# Altium schematic sheet 102709.SchDoc: EAX-500 Test Head Board
size A4; CompanyName: Detex Corp; DrawnBy: DMH; Engineer: DMH; Address2: Detex Corp; Address3: 302 Detex Dr; Address4: New Braunfels, TX 78130; DocumentNumber: 102709; Revision: A0; SheetNumber: 1; SheetTotal: 1; ProjectName: EAX-500 Test Head Board
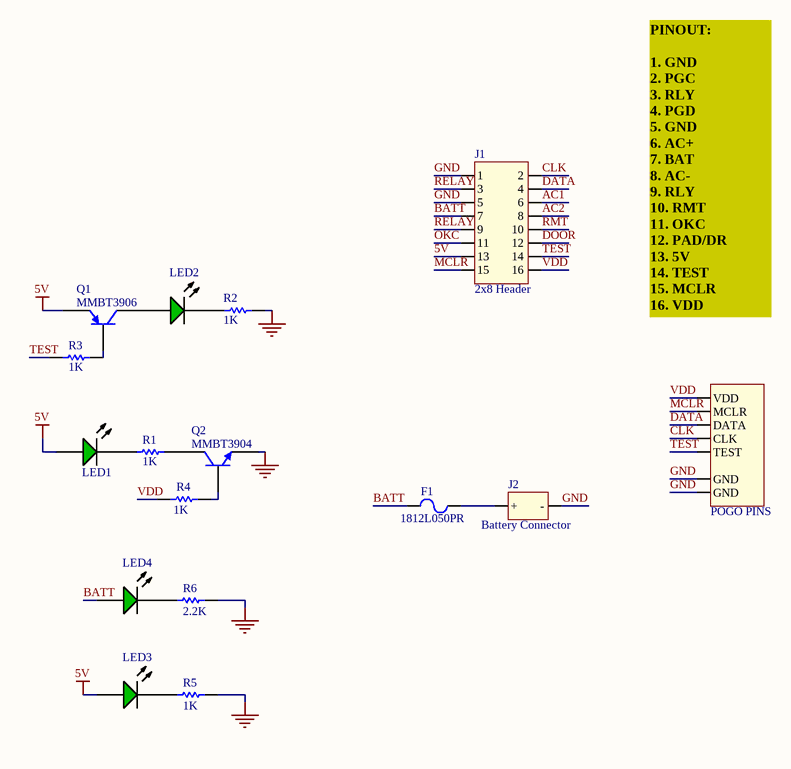
[diagram p0: 102709.SchDoc]

## Parts
F1  1812L050PR  [LFUS-1812L050_V]
J1  2x8 Header  [2x9_header]
J2  Battery Connector  [Battery Connector]
LED1  HSMG-C150  [AVAG-HSMX-C150_V]  (value not drawn)
LED2  HSMG-C150  [AVAG-HSMX-C150_V]  (value not drawn)
LED3  HSMG-C150  [AVAG-HSMX-C150_V]  (value not drawn)
LED4  HSMG-C150  [AVAG-HSMX-C150_V]  (value not drawn)
P1  POGO PINS  [EAX500 POGOS]
Q1  MMBT3906  [FAIR-SOT23-3_V]
Q2  MMBT3904  [FAIR-SOT23-3_V]
R1  value 1K  [RESC0805(2012)_M]  (hidden comment: Res1)
R2  value 1K  [RESC0805(2012)_M]  (hidden comment: Res1)
R3  value 1K  [RESC0805(2012)_M]  (hidden comment: Res1)
R4  value 1K  [RESC0805(2012)_M]  (hidden comment: Res1)
R5  value 1K  [RESC0805(2012)_M]  (hidden comment: Res1)
R6  value 2.2K  [RESC0805(2012)_M]  (hidden comment: Res1)

## Nets
5V: J1.13 LED1.1(A) LED3.1(A) Q1.2(E)
GND: J1.1 J1.5 J2.2(-) P1.2(GND) P1.8(GND) Q2.2(E) R2.2 R5.2 R6.2
AC1: J1.6
AC2: J1.8
BATT: F1.1 J1.7 LED4.1(A)
CLK: J1.2 P1.3(CLK)
DATA: J1.4 P1.4(DATA)
DOOR: J1.12
MCLR: J1.15 P1.5(MCLR)
OKC: J1.11
RELAY: J1.3 J1.9
RMT: J1.10
TEST: J1.14 P1.7(TEST) R3.2
VDD: J1.16 P1.6(VDD) R4.1
NetF1_2: F1.2 J2.1(+)
NetLED1_2: LED1.2(K) R1.1
NetLED2_1: LED2.1(A) Q1.3(C)
NetLED2_2: LED2.2(K) R2.1
NetLED3_2: LED3.2(K) R5.1
NetLED4_2: LED4.2(K) R6.1
NetQ1_1: Q1.1(B) R3.1
NetQ2_1: Q2.1(B) R4.2
NetQ2_3: Q2.3(C) R1.2

## Notes on the sheet
- PINOUT:
  1. GND
  2. PGC
  3. RLY
  4. PGD
  5. GND
  6. AC+
  7. BAT
  8. AC-
  9. RLY
  10. RMT
  11. OKC
  12. PAD/DR
  13. 5V
  14. TEST
  15. MCLR
  16. VDD
- Title:
- Size:
- Date:
- A4
- P/N:
- Time:
- Revision:
- Sheet
- of
- (830) 629-2900 x4370
- File:

## Library data of the parts
F1 = CMP-1700-00002-1: POLY-FUSE(R) Resettable PTC, 0.5 A, 0.15 to 1 Ohm Resistance, -40 to 85 degC, 1812 (4532 Metric), RoHS, Tape and Reel; Voltage Rating: 50 V; Power Rating: 100 mW; Resistance: 150 kohm; Tolerance: 1%; Case\Package: 0603; ComponentLink2URL: http://www.littelfuse.com/~/media/electronics/datasheets/resettable_ptcs/littelfuse_ptc_1812l_datasheet.pdf.pdf; Pins: 2; Mount: Surface Mount; Width: 0.8 mm; Length: 1.6 mm; Package Quantity: 1; Max Operating Temperature: 155 degC; Case Code (Imperial): 0603; ComponentLink1Description: Manufacturer URL; PackageReference: 1812; ComponentLink1URL: http://www.littelfuse.com/; RoHSCompliant: true; Voltage Rating (DC): 50 V; Packaging: Tape and Reel; PackageDescription: 2-Pin Surface Mount Device, Body 4.55 x 3.24 mm; Min Operating Temperature: -55 degC; DatasheetVersion: Feb-16; REACH SVHC: No SVHC; Case Code (Metric): 1608; ComponentLink2Description: Datasheet; Height: 0.45 mm
J1 = 2x9 Header
LED1-LED4 = CMP-2000-05061-1: Chip LED, Green, 65 mW, 25 mA, -40 to 85 degC, 2-Pin SMD, RoHS, Tape and Reel; Manufacturer: Avago; Forward Voltage VF Max: 2.6V; Forward Current If Max: 20mA; Bulb Size: 1.6mmx2mm; PIV Max: 5V; Dominant Wavelength: 572nm; External Length / Height: 3.2mm; SVHC: NoSVHC(16-Jun-2014); Viewing Angle: 170deg; Peak Wavelength: 570nm; External Width: 1.6mm; No. of Pins: 2; Luminous Intensity Typ: 15mcd; Light Output Orientation: TopEmitting; LED Type: Standard; Luminous Intensity @ If Min: 4.5mcd; Voltage Vf Min: 2.2V; Lens Shape: Rectangular; External Depth: 1.1mm; Material: GaP; Opto Mounting Orientation: Top; Package Reference: HSMX-C150; Mounting Type: SMD; Datasheet Version: Mar-12; Storage Temperature Max: 85degC; Forward Current If: 20mA; Operating Temperature Min: -30degC; Operating Temperature Max: 85degC; Wavelength Typ: 572nm; Datasheet URL: https://datasheet.ciiva.com/11774/0900766b804a6539-11774272.pdf; Luminous Intensity: 15mcd; Manufacturer URL: http://www.avagotech.com/; Storage Temperature Min: -40degC; Package Description: 2-Pin Surface Mount Device, Body 3.2 x 1.6 mm; MSL: MSL2A-4weeks; LED Colour: Green; Operating Temperature Range: -30degCto+85degC; LED Mounting: SMD; Voltage Vf Typ: 2.2V; Opto Case Style: SMD; Packaging: CutTape; Forward Voltage: 2.2V; Reverse Protection Voltage: 5V
P1 = EAX500 POGO
Q1 = CMP-1670-00011-1: PNP General-Purpose Amplifier, 40 V, 0.2 A, -55 to 150 degC, 3-Pin SOT23, RoHS, Tape and Reel; Tolerance: 20%; Capacitance: 1 uF; Voltage Rating (DC): 50 V; Case\Package: Radial; Radiation Hardening: No; REACH SVHC: No SVHC; Height: 11 mm; Length: 12 mm; Pins: 2; Min Operating Temperature: -55 degC; ComponentLink1Description: Manufacturer URL; Mount: Through Hole; ComponentLink2URL: https://www.fairchildsemi.com/datasheets/MM/MMBT3906.pdf; ComponentLink3Description: Package Specification; Package Quantity: 200; Diameter: 5 mm; Width: 0 inch; Voltage Rating: 50 V; ComponentLink2Description: Datasheet; PackageDescription: 3-Pin Small Outline Transistor, Body 2.92 x 1.325 mm, Pitch 0.95 mm; DatasheetVersion: Rev. 1.2.2, 04/2014; Max Operating Temperature: 105 degC; RoHSCompliant: true; PackageReference: SOT23-3; Lead Pitch: 2 mm; Packaging: Bulk; ComponentLink3URL: http://www.fairchildsemi.com/dwg/MA/MA03D.pdf; ComponentLink1URL: https://www.fairchildsemi.com/
Q2 = CMP-1670-00008-1: NPN General Purpose Amplifier, 40 V, 0.2 A, -55 to 150 degC, 3-Pin SOT23, RoHS, Tape and Reel; Tolerance: 30ppm; Capacitance: 1.8E-11 f; Frequency: 12.288 MHz; ESR: 40 Ohm; Load Capacitance: 18 pF; REACH SVHC: No SVHC; Pins: 4; ComponentLink3URL: http://www.fairchildsemi.com/dwg/MA/MA03D.pdf; PackageDescription: 3-Pin Small Outline Transistor, Body 2.92 x 1.325 mm, Pitch 0.95 mm; ComponentLink1URL: https://www.fairchildsemi.com/; Max Operating Temperature: 70degC; PackageReference: SOT23-3; ComponentLink1Description: Manufacturer URL; Width: 0.126 inch; Min Operating Temperature: -20degC; DatasheetVersion: Rev. 1.1.0, 10/2014; Mount: Surface Mount; Height: 0.041 inch; Package Quantity: 1000; Frequency Tolerance: 30ppm; Packaging: Tape and Reel; ComponentLink2URL: https://www.fairchildsemi.com/datasheets/MM/MMBT3904.pdf; RoHSCompliant: True; ComponentLink3Description: Package Specification; ComponentLink2Description: Datasheet; Length: 0.197 inch
R1-R6 = Res1: Resistor; Published: 8-Jun-2000; LatestRevisionDate: 17-Jul-2002; LatestRevisionNote: Re-released for DXP Platform.; PackageReference: AXIAL-0.3; Publisher: Altium Limited; PackageDescription: Axial Device, Thru-Hole; 2 Leads; 0.3 in Pin Spacing